# EasyEDA Pro project MasterControlBoard.eprj

# Schematic MasterControlBoard

## Sheets
1 STM32H7-Core: Create Date: 2023-12-24; Page Name: STM32H7-Core; Project Name: MasterControlBoard; Schematic Name: MasterControlBoard; Update Date: 2023-12-28; Add into BOM: yes; Company: CodingBugStd; Convert to PCB: yes; Drawed: CodingBugStd; Page Size: A3; Version: V1.0
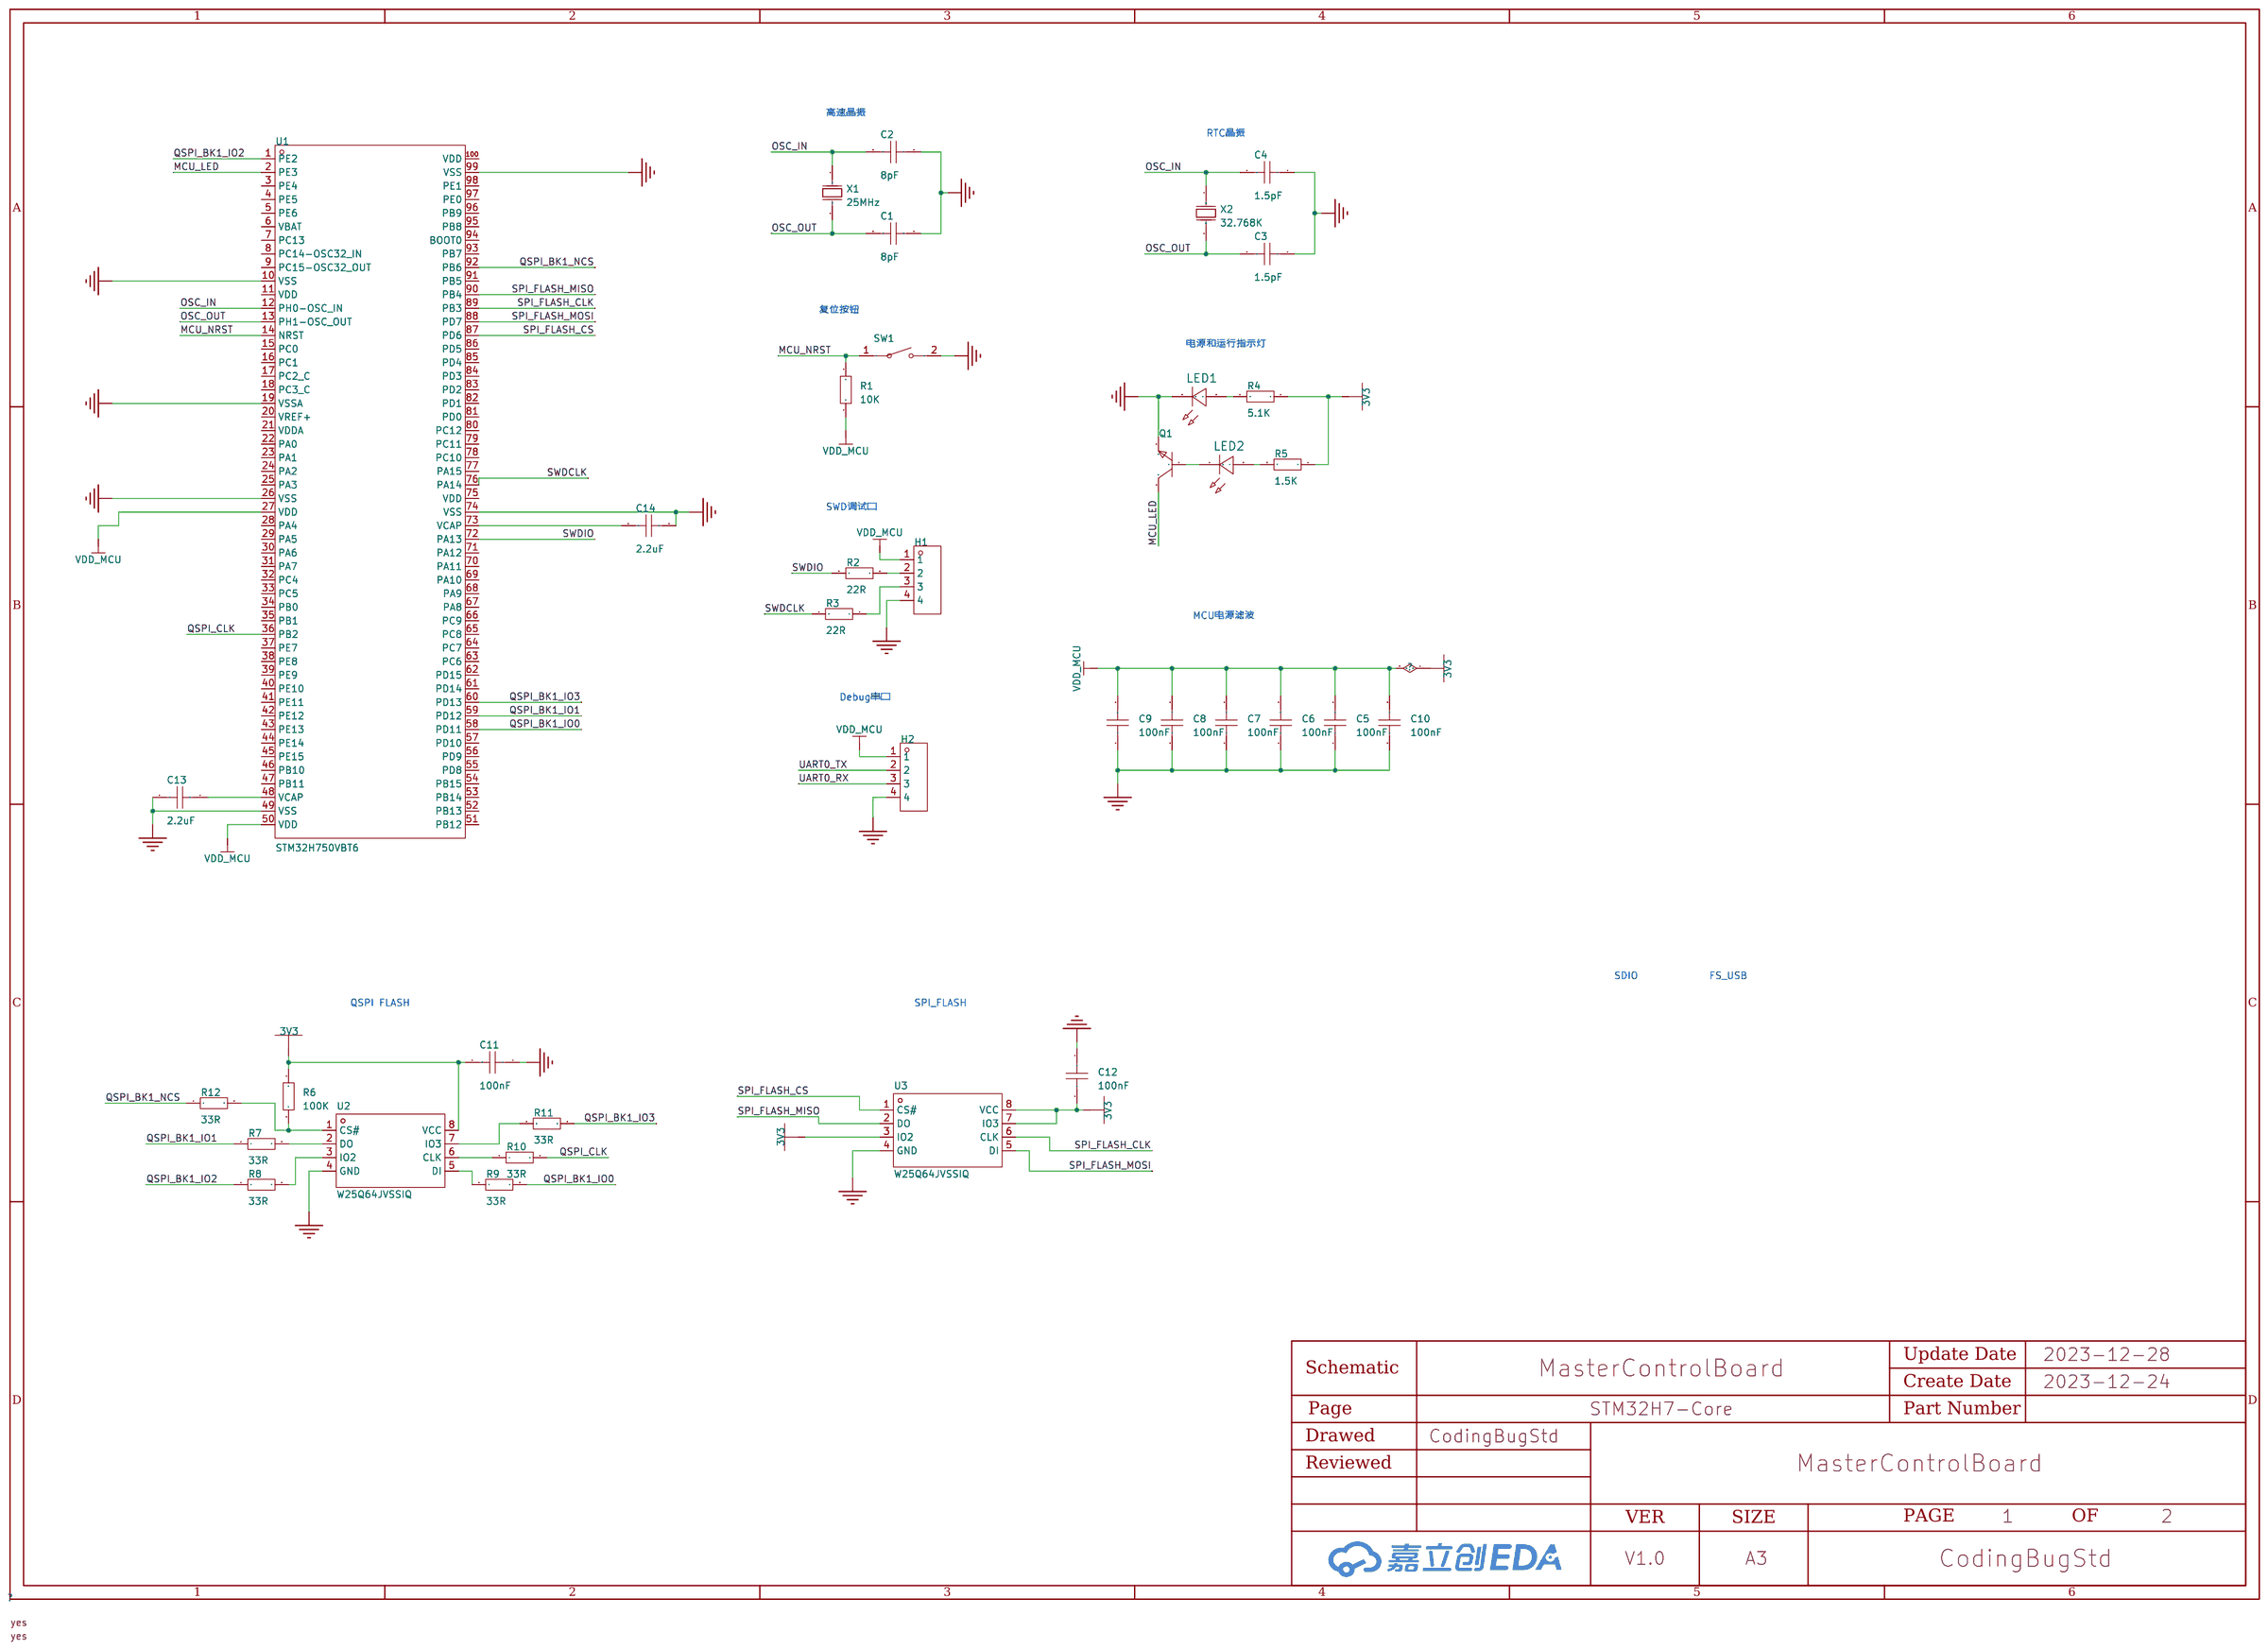
[diagram p0: STM32H7-Core]
2 Power: Create Date: 2023-12-26; Page Name: Power; Update Date: 2023-12-27; Company: 嘉立创EDA; Page Size: A4
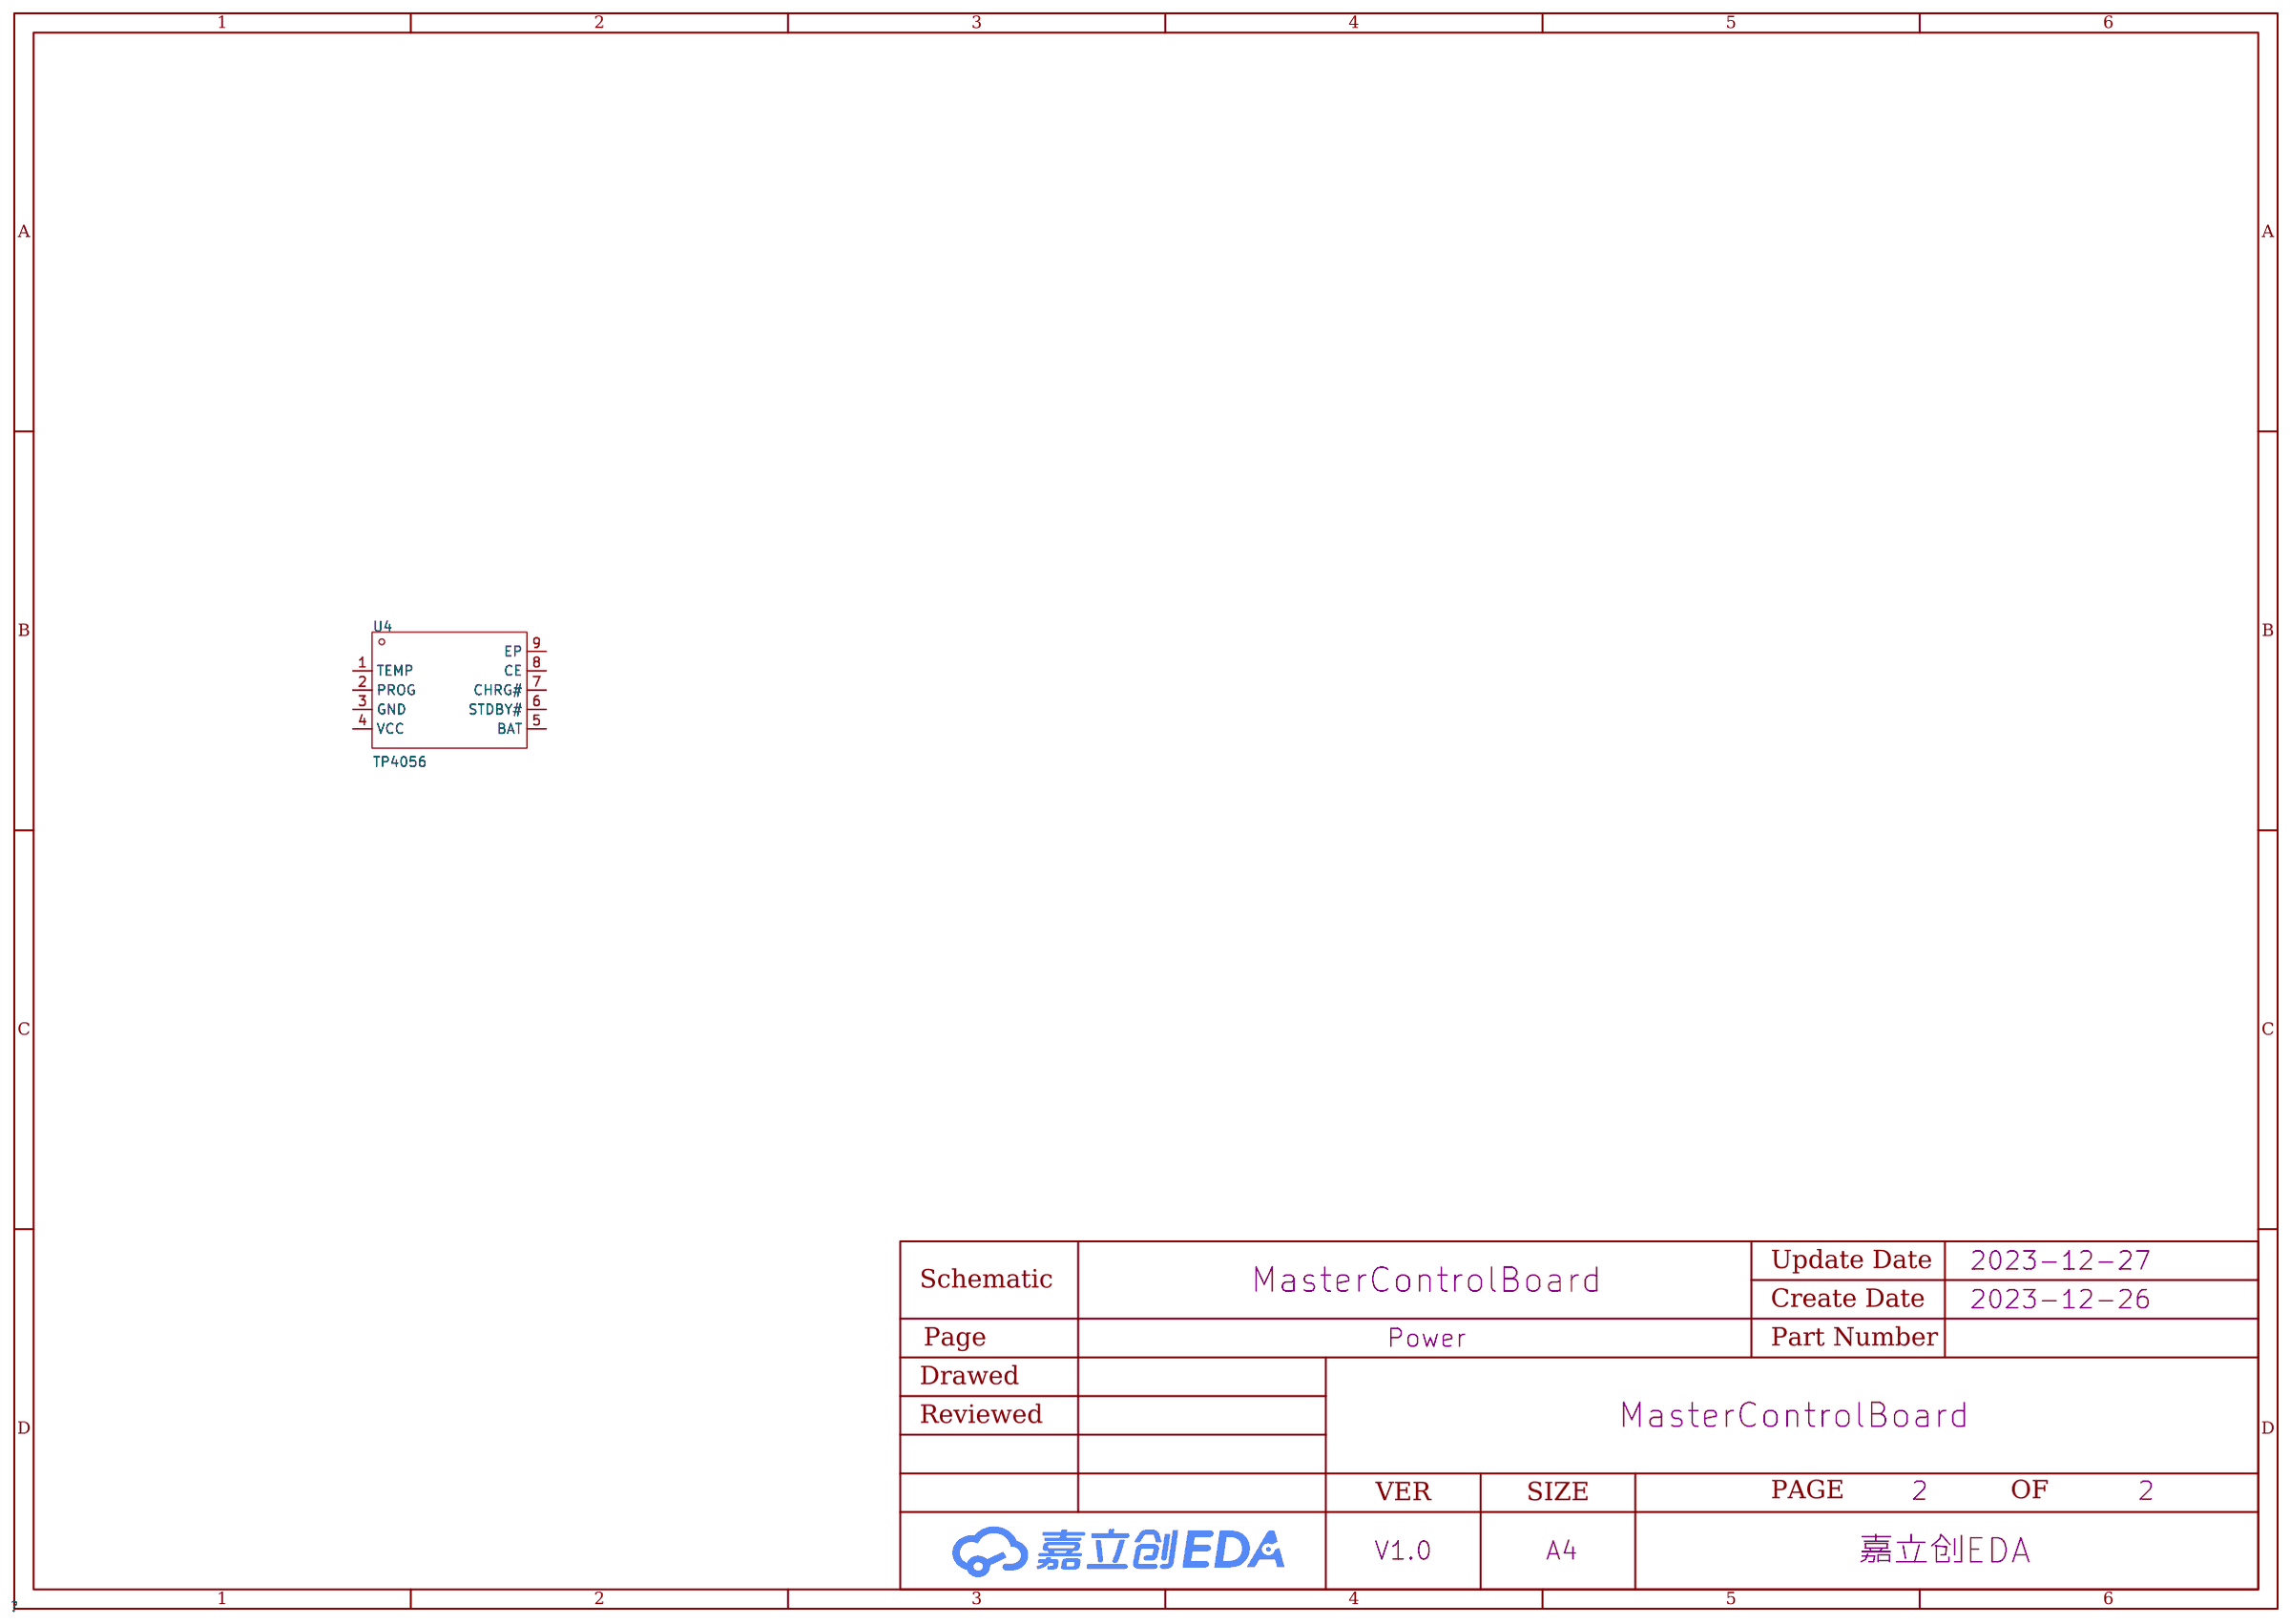
[diagram p1: Power]

## Parts
sheet Power
U4  TP4056  [ESOP-8_L4.9-W3.9-P1.27-LS6.0-BL-EP]
sheet STM32H7-Core
C1  8pF  [C0603]
C2  8pF  [C0603]
C3  1.5pF  [C0603]
C4  1.5pF  [C0603]
C5  100nF  [C0603]
C6  100nF  [C0603]
C7  100nF  [C0603]
C8  100nF  [C0603]
C9  100nF  [C0603]
C10  100nF  [C0603]
C11  100nF  [C0603]
C12  100nF  [C0603]
C13  2.2uF  [C0603]
C14  2.2uF  [C0603]
H1  -  [HDR-TH_4P-P2.54-V-F]
H2  -  [HDR-TH_4P-P2.54-V-F]
LED1  -  [LED0603-RD_BLUE]
LED2  -  [LED0603-RD_BLUE]
Q1  -  [SOT-23_L2.9-W1.3-P1.90-LS2.4-BR]
R1  10K  [R0603]
R2  22R  [R0603]
R3  22R  [R0603]
R4  5.1K  [R0603]
R5  1.5K  [R0603]
R6  100K  [R0603]
R7  33R  [R0603]
R8  33R  [R0603]
R9  33R  [R0603]
R10  33R  [R0603]
R11  33R  [R0603]
R12  33R  [R0603]
SW1  K2-1107ST-A4DW-06  [KEY-SMD_L6.2-W3.6-LS8.0]
U1  STM32H750VBT6  [LQFP-100_L14.0-W14.0-P0.50-LS16.0-BL]
U2  W25Q64JVSSIQ  [SOP-8_L5.3-W5.3-P1.27-LS8.0-BL]
U3  W25Q64JVSSIQ  [SOP-8_L5.3-W5.3-P1.27-LS8.0-BL]
X1  25MHz  [HC-49US_L11.5-W4.5-P4.88]
X2  32.768K  [HC-49US_L11.5-W4.5-P4.88]

## Library data of the parts
U4 = TP4056_C382139: LCSC Part Name: 1A锂电池充电IC; Supplier Part: C382139; Manufacturer: TPOWER(天源); Supplier Footprint: ESOP-8; JLCPCB Part Class: 扩展库; Datasheet: https://atta.szlcsc.com/upload/public/pdf/source/20190327/C382139_EC85960E6FE3E26856C240C81751A184.pdf; Supplier: LCSC
C1-C14 = CAP_0603: Supplier Footprint: 0603
H1 H2 = HDR-F_2.54_1x4P: Supplier Part: C2718488; Supplier Footprint: 插件
LED1 LED2 = LED_0603-R: 发光颜色:红灯;二极管配置:-;透镜颜色:无色透明;主波长:617.5nm;峰值波长:632nm;色温:-;光通量(25℃时):-;测试电流:5mA;正向电压(VF):2.2V;发光强度:28.5mcd;功率:60mW;发光角度:120°;安装方式:-;工作温度:-40℃~+85℃;; Supplier Footprint: 0603; Supplier Part: C72044
Q1 = S8050_NPN: 晶体管类型:NPN;集射极击穿电压(Vceo):25V;集电极电流(Ic):500mA;功率(Pd):300mW;集电极-发射极饱和电压(VCE(sat)@Ic,Ib):600mV@500mA,50mA;直流电流增益(hFE@Ic,Vce):-;特征频率(fT):150MHz;工作温度:+150℃@(Tj);; Supplier Part: C444723; Supplier Footprint: SOT-23
R1-R12 = Res_0603: Supplier Footprint: 0603
SW1 = K2-1107ST-A4DW-06_C118141: 触点电流:50mA;额定电压(DC):12V;绝缘电阻:100MΩ;电路结构:单刀单掷;安装方式:立贴;按钮形状:矩形按钮;带灯:-;作用力:250gf@±30gf;机械寿命:100000;工作温度:-25℃~+85℃;开关长度:6.1mm;开关宽度:3.6mm;开关高度:2.5mm;; LCSC Part Name: 轻触开关 3.6*6.1*2.5; Supplier Part: C118141; Manufacturer: 韩国韩荣; Supplier Footprint: SMD; Datasheet: https://atta.szlcsc.com/upload/public/pdf/source/20210810/381712CEF248770C072B585C3485C888.pdf; Supplier: LCSC; Contact Current: 50mA; Voltage Rating (DC): 12V; Insulation Resistance: 100MΩ; Circuit: 单刀单掷; Mounting Style: 立贴; Actuator Style: 矩形按钮; Operating Force: 250gf@±30gf; Mechanical Life: 100000; Operating Temperature: -25℃~+85℃; Switch Length: 6.1mm; Switch Width: 3.6mm; Switch Height: 2.5mm
U1 = STM32H750VBT6: ARMCortexM7微控制器 32位 480MHz 128KB（128Kx8）闪存; Supplier Part: C404010; Manufacturer: ST(意法半导体); Supplier Footprint: LQFP-100; JLCPCB Part Class: Extended Part; Datasheet: https://atta.szlcsc.com/upload/public/pdf/source/20190722/C404010_6028FDD7E25CA1D71DA8F4066CF0EFF7.pdf; Supplier: LCSC
U2 U3 = W25Q64JVSSIQ_C83140: 64M-bit/8M-byte FLASH芯片,SPI接口 133MHz(266/532MHz Dual/Quad-SPI) 比W25Q64FVSSIG更高速度; Supplier Part: C83140; Manufacturer: WINBOND(华邦); Supplier Footprint: SOP-8-208mil; JLCPCB Part Class: 扩展库; Datasheet: https://atta.szlcsc.com/upload/public/pdf/source/20161110/1478742546019.pdf; Supplier: LCSC
X1 X2 = X49SD25MSD2SC: 晶振类型:49S晶振;频率:25MHz;频率公差:±20ppm;频率稳定度:±30ppm;负载电容:20pF;工作温度:-20℃~+70℃;; LCSC Part Name: HC-49US 25MHz ±20ppm 20pF; Supplier Part: C14730; Manufacturer: YXC(扬兴科技); Supplier Footprint: HC-49S-2P; JLCPCB Part Class: Extended Part; Datasheet: https://atta.szlcsc.com/upload/public/pdf/source/20210903/A997D130AE99CBB55D9024F9BE6DA174.pdf; Supplier: LCSC; Crystal Type: 49S晶振; Frequency Tolerance: ±20ppm; Frequency Stability: ±30ppm; Load Capacitance: 20pF; Operating Temperature: -20℃~+70℃

## Nets
3V3: C5.2 C6.2 C7.2 C8.2 C9.2 C10.2 C11.2 C12.2 H1.1 H2.1 R1.1 R4.1 R5.1 R6.1 U1.27(VDD) U1.50(VDD) U2.8(VCC) U3.3(IO2) U3.7(IO3) U3.8(VCC)
GND: C1.1 C2.1 C3.1 C4.1 C5.1 C6.1 C7.1 C8.1 C9.1 C10.1 C11.1 C12.1 C13.2 C14.1 H1.4 H2.4 LED1.1(C) Q1.2(B) SW1.2 U1.10(VSS) U1.19(VSSA) U1.26(VSS) U1.49(VSS) U1.74(VSS) U1.99(VSS) U2.4(GND) U3.4(GND)
MCU_LED: Q1.3(C) U1.2(PE3)
MCU_NRST: R1.2 SW1.1 U1.14(NRST)
OSC_IN: C2.2 C4.2 U1.12(PH0-OSC_IN) X1.1(OSC1) X2.1(OSC1)
OSC_OUT: C1.2 C3.2 U1.13(PH1-OSC_OUT) X1.2(OSC2) X2.2(OSC2)
QSPI_BK1_IO0: R9.2 U1.58(PD11)
QSPI_BK1_IO1: R7.1 U1.59(PD12)
QSPI_BK1_IO2: R8.1 U1.1(PE2)
QSPI_BK1_IO3: R11.2 U1.60(PD13)
QSPI_BK1_NCS: R12.1 U1.92(PB6)
QSPI_CLK: R10.2 U1.36(PB2)
SPI_FLASH_CLK: U1.89(PB3) U3.6(CLK)
SPI_FLASH_CS: U1.87(PD6) U3.1(CS#)
SPI_FLASH_MISO: U1.90(PB4) U3.2(DO)
SPI_FLASH_MOSI: U1.88(PD7) U3.5(DI)
SWDCLK: R3.2 U1.76(PA14)
SWDIO: R2.1 U1.72(PA13)
UART0_RX: H2.3
UART0_TX: H2.2
Net-(C13-1): C13.1 U1.48(VCAP)
Net-(C14-2): C14.2 U1.73(VCAP)
Net-(H1-2): H1.2 R2.2
Net-(H1-3): H1.3 R3.1
Net-(LED1-2): LED1.2(A) R4.2
Net-(LED2-1): LED2.1(C) Q1.1(E)
Net-(LED2-2): LED2.2(A) R5.2
Net-(R6-2): R6.2 R12.2 U2.1(CS#)
Net-(R7-2): R7.2 U2.2(DO)
Net-(R8-2): R8.2 U2.3(IO2)
Net-(R9-1): R9.1 U2.5(DI)
Net-(R10-1): R10.1 U2.6(CLK)
Net-(R11-1): R11.1 U2.7(IO3)

Not connected (* = marked no-connect by the designer): U1 3(PE4) 4(PE5) 5(PE6) 6(VBAT) 7(PC13) 8(PC14-OSC32_IN) 9(PC15-OSC32_OUT) 11(VDD) 15(PC0) 16(PC1) 17(PC2_C) 18(PC3_C) 20(VREF+) 21(VDDA) 22(PA0) 23(PA1) 24(PA2) 25(PA3) 28(PA4) 29(PA5) 30(PA6) 31(PA7) 32(PC4) 33(PC5) 34(PB0) 35(PB1) 37(PE7) 38(PE8) 39(PE9) 40(PE10) 41(PE11) 42(PE12) 43(PE13) 44(PE14) 45(PE15) 46(PB10) 47(PB11) 51(PB12) 52(PB13) 53(PB14) 54(PB15) 55(PD8) 56(PD9) 57(PD10) 61(PD14) 62(PD15) 63(PC6) 64(PC7) 65(PC8) 66(PC9) 67(PA8) 68(PA9) 69(PA10) 70(PA11) 71(PA12) 75(VDD) 77(PA15) 78(PC10) 79(PC11) 80(PC12) 81(PD0) 82(PD1) 83(PD2) 84(PD3) 85(PD4) 86(PD5) 91(PB5) 93(PB7) 94(BOOT0) 95(PB8) 96(PB9) 97(PE0) 98(PE1) 100(VDD); U4 1(TEMP) 2(PROG) 3(GND) 4(VCC) 5(BAT) 6(STDBY#) 7(CHRG#) 8(CE) 9(EP)

## Notes on the sheets
sheet 1
- 高速晶振
- RTC晶振
- 复位按钮
- 电源和运行指示灯
- SWD调试口
- MCU电源滤波
- Debug串口
- SDIO
- FS_USB
- QSPI FLASH
- SPI_FLASH
